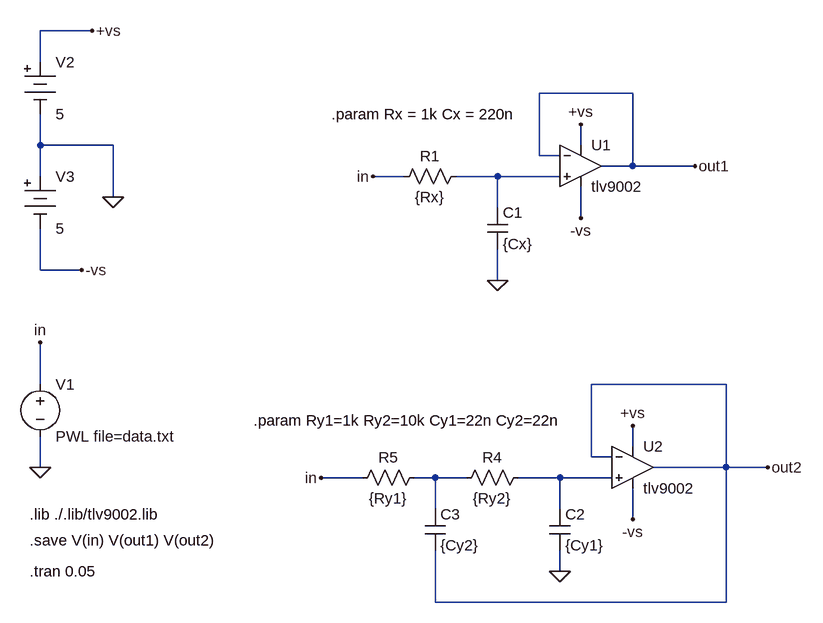
[diagram p0: schematic harmonic.asc]
harmonic.asc, the LTspice schematic file:
Version 4.1
SHEET 1 880 724
WIRE -368 -176 -448 -176
WIRE -448 -128 -448 -176
WIRE 464 -80 320 -80
WIRE -448 0 -448 -48
WIRE -336 0 -448 0
WIRE 384 0 384 -32
WIRE 320 16 320 -80
WIRE 352 16 320 16
WIRE 464 32 464 -80
WIRE 464 32 416 32
WIRE 560 32 464 32
WIRE -448 48 -448 0
WIRE 112 48 64 48
WIRE 256 48 192 48
WIRE 352 48 256 48
WIRE -336 80 -336 0
WIRE 256 96 256 48
WIRE 384 112 384 64
WIRE -448 192 -448 128
WIRE -384 192 -448 192
WIRE 256 208 256 160
WIRE -448 368 -448 304
WIRE 608 368 400 368
WIRE 464 464 464 432
WIRE 400 480 400 368
WIRE 432 480 400 480
WIRE -448 496 -448 448
WIRE 608 496 608 368
WIRE 608 496 496 496
WIRE 672 496 608 496
WIRE 48 512 -16 512
WIRE 160 512 128 512
WIRE 208 512 160 512
WIRE 352 512 288 512
WIRE 432 512 352 512
WIRE 160 560 160 512
WIRE 352 560 352 512
WIRE 464 576 464 528
WIRE 352 656 352 624
WIRE 160 704 160 624
WIRE 608 704 608 496
WIRE 608 704 160 704
FLAG -448 496 0
FLAG -448 304 in
FLAG -384 192 -vs
FLAG -368 -176 +vs
FLAG 384 112 -vs
FLAG 384 -32 +vs
FLAG -336 80 0
FLAG 256 208 0
FLAG 64 48 in
FLAG 560 32 out1
FLAG 464 432 +vs
FLAG 464 576 -vs
FLAG 352 656 0
FLAG -16 512 in
FLAG 672 496 out2
SYMBOL voltage -448 352 R0
WINDOW 123 0 0 Left 0
WINDOW 39 0 0 Left 0
SYMATTR InstName V1
SYMATTR Value PWL file=data.txt
SYMBOL OpAmps\\opamp2 384 -32 R0
SYMATTR InstName U1
SYMATTR Value tlv9002
SYMBOL Misc\\battery -448 -144 R0
WINDOW 123 0 0 Left 0
WINDOW 39 0 0 Left 0
SYMATTR InstName V2
SYMATTR Value 5
SYMBOL Misc\\battery -448 32 R0
WINDOW 123 0 0 Left 0
WINDOW 39 0 0 Left 0
SYMATTR InstName V3
SYMATTR Value 5
SYMBOL res 208 32 R90
WINDOW 0 0 56 VBottom 2
WINDOW 3 32 56 VTop 2
SYMATTR InstName R1
SYMATTR Value {Rx}
SYMBOL cap 240 96 R0
SYMATTR InstName C1
SYMATTR Value {Cx}
SYMBOL OpAmps\\opamp2 464 432 R0
SYMATTR InstName U2
SYMATTR Value tlv9002
SYMBOL res 304 496 R90
WINDOW 0 0 56 VBottom 2
WINDOW 3 32 56 VTop 2
SYMATTR InstName R4
SYMATTR Value {Ry2}
SYMBOL cap 336 560 R0
SYMATTR InstName C2
SYMATTR Value {Cy1}
SYMBOL res 144 496 R90
WINDOW 0 0 56 VBottom 2
WINDOW 3 32 56 VTop 2
SYMATTR InstName R5
SYMATTR Value {Ry1}
SYMBOL cap 144 560 R0
SYMATTR InstName C3
SYMATTR Value {Cy2}
TEXT -464 656 Left 2 !.tran 0.05
TEXT -464 568 Left 2 !.lib ./.lib/tlv9002.lib
TEXT -464 608 Left 2 !.save V(in) V(out1) V(out2)
TEXT 0 -48 Left 2 !.param Rx = 1k Cx = 220n
TEXT -120 424 Left 2 !.param Ry1=1k Ry2=10k Cy1=22n Cy2=22n

The netlist it stands for:
* harmonic.asc
V1 in 0 PWL file=data.txt
X§U1 N001 out1 +vs -vs out1 tlv9002  ; pins In+ In- V+ V- OUT
V2 +vs 0 5
V3 0 -vs 5
R1 N001 in {Rx}
C1 N001 0 {Cx}
X§U2 N003 out2 +vs -vs out2 tlv9002  ; pins In+ In- V+ V- OUT
R4 N003 N002 {Ry2}
C2 N003 0 {Cy1}
R5 N002 in {Ry1}
C3 N002 out2 {Cy2}
.tran 0.05
.lib ./.lib/tlv9002.lib
.save V(in) V(out1) V(out2)
.param Rx = 1k Cx = 220n
.param Ry1=1k Ry2=10k Cy1=22n Cy2=22n
.backanno
.end